# EAGLE design cpx-synth2-B (EAGLE 8.6.3)
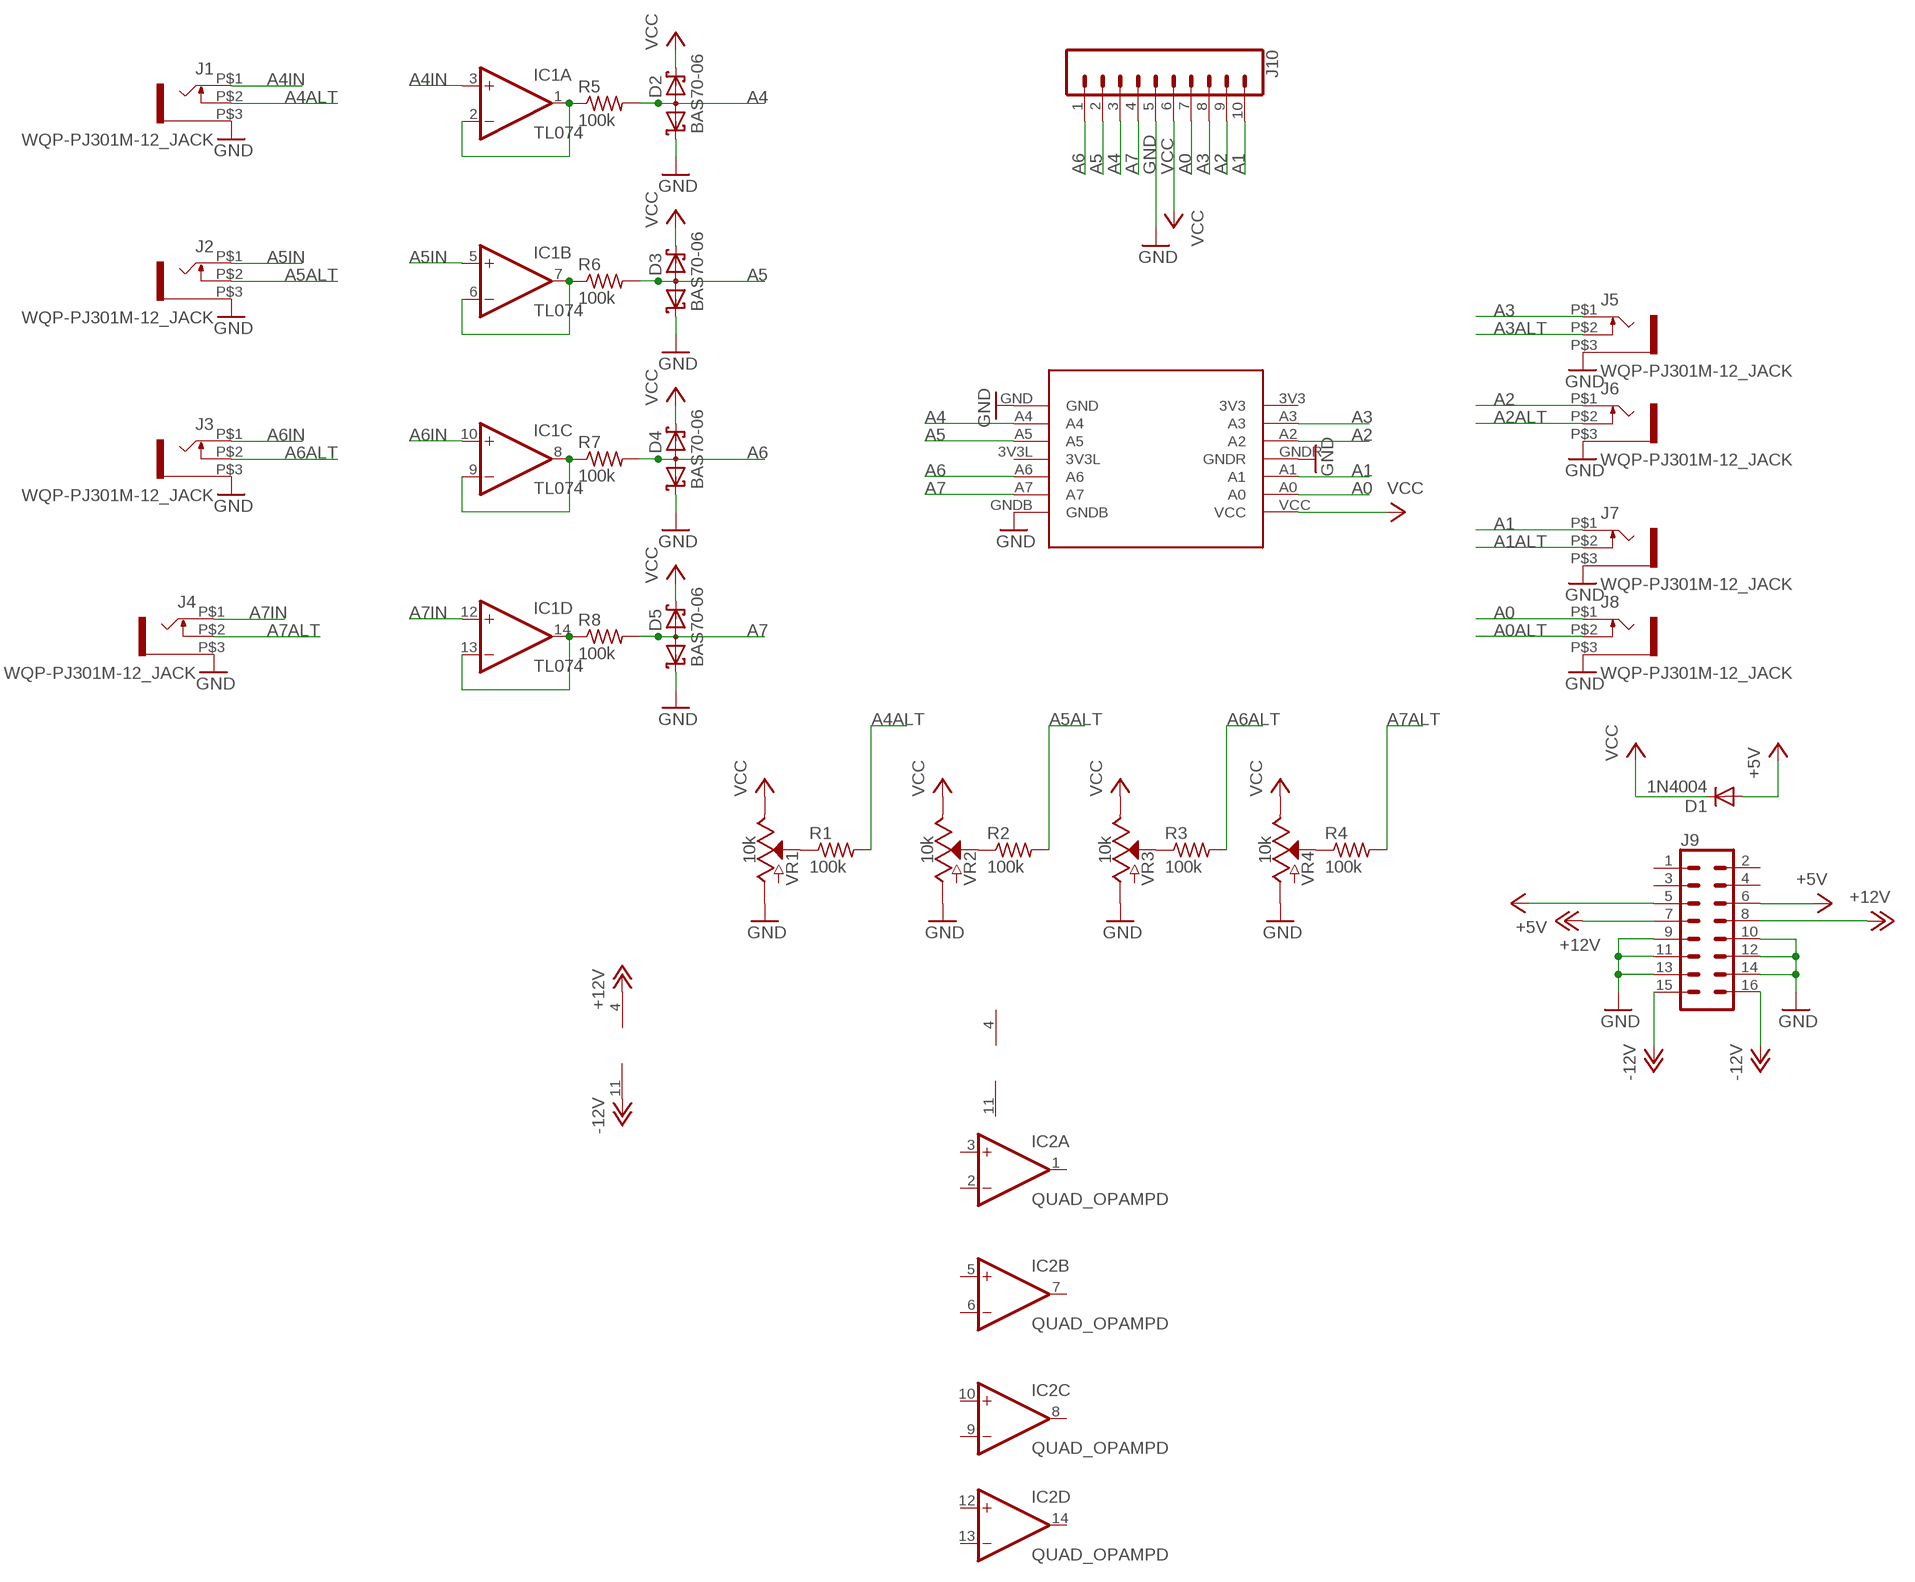
[diagram p0: schematic, sheet 1]

## Parts
D1  1N4004  [DO41-10]
D2  BAS70-06  [SOT23]
D3  BAS70-06  [SOT23]
D4  BAS70-06  [SOT23]
D5  BAS70-06  [SOT23]
IC1  TL074  QUAD_OPAMPD  [SO14]
IC2  QUAD_OPAMPD  [SO14]
J1  WQP-PJ301M-12_JACK  [WQP-PJ301M-12_JACK]
J2  WQP-PJ301M-12_JACK  [WQP-PJ301M-12_JACK]
J3  WQP-PJ301M-12_JACK  [WQP-PJ301M-12_JACK]
J4  WQP-PJ301M-12_JACK  [WQP-PJ301M-12_JACK]
J5  WQP-PJ301M-12_JACK  [WQP-PJ301M-12_JACK]
J6  WQP-PJ301M-12_JACK  [WQP-PJ301M-12_JACK]
J7  WQP-PJ301M-12_JACK  [WQP-PJ301M-12_JACK]
J8  WQP-PJ301M-12_JACK  [WQP-PJ301M-12_JACK]
J9  CONN_08X2  [2X8]
J10  CONN_10"  [1X10]
R1  100k  R-US_R0603  [R0603]
R2  100k  R-US_R0603  [R0603]
R3  100k  R-US_R0603  [R0603]
R4  100k  R-US_R0603  [R0603]
R5  100k  R-US_R0603  [R0603]
R6  100k  R-US_R0603  [R0603]
R7  100k  R-US_R0603  [R0603]
R8  100k  R-US_R0603  [R0603]
U1  CIRCUITPLAYGROUNDEXPRESS  [CIRCUITPLAYGROUNDEXPRESS]
VR1  10k  POTENTIOMETER-PTH-9MM-1/20W-20%-KIT  [POT-PTH-ALPS-KIT]
VR2  10k  POTENTIOMETER-PTH-9MM-1/20W-20%-KIT  [POT-PTH-ALPS-KIT]
VR3  10k  POTENTIOMETER-PTH-9MM-1/20W-20%-KIT  [POT-PTH-ALPS-KIT]
VR4  10k  POTENTIOMETER-PTH-9MM-1/20W-20%-KIT  [POT-PTH-ALPS-KIT]

## Nets
+5V: D1.A J9.5 J9.6
+12V: IC1.4(P:V+) J9.7 J9.8
-12V: IC1.11(P:V-) J9.15 J9.16
A0: J8.P$1 J10.7 U1.A0
A0ALT: J8.P$2
A1: J7.P$1 J10.10 U1.A1
A1ALT: J7.P$2
A2: J6.P$1 J10.9 U1.A2
A2ALT: J6.P$2
A3: J5.P$1 J10.8 U1.A3
A3ALT: J5.P$2
A4: D2.3(AA) J10.3 R5.2 U1.A4
A4ALT: J1.P$2 R1.2
A4IN: IC1.3(A:+IN) J1.P$1
A5: D3.3(AA) J10.2 R6.2 U1.A5
A5ALT: J2.P$2 R2.2
A5IN: IC1.5(B:+IN) J2.P$1
A6: D4.3(AA) J10.1 R7.2 U1.A6
A6ALT: J3.P$2 R3.2
A6IN: IC1.10(C:+IN) J3.P$1
A7: D5.3(AA) J10.4 R8.2 U1.A7
A7ALT: J4.P$2 R4.2
A7IN: IC1.12(D:+IN) J4.P$1
GND: D2.1(K1) D3.1(K1) D4.1(K1) D5.1(K1) J1.P$3 J2.P$3 J3.P$3 J4.P$3 J5.P$3 J6.P$3 J7.P$3 J8.P$3 J9.9 J9.10 J9.11 J9.12 J9.13 J9.14 J10.5 U1.GND U1.GNDB U1.GNDR VR1.P$3(A) VR2.P$3(A) VR3.P$3(A) VR4.P$3(A)
N$1: R1.1 VR1.P$2(S)
N$2: R2.1 VR2.P$2(S)
N$3: R3.1 VR3.P$2(S)
N$4: R4.1 VR4.P$2(S)
N$5: IC1.6(B:-IN) IC1.7(B:OUT) R6.1
N$6: IC1.8(C:OUT) IC1.9(C:-IN) R7.1
N$7: IC1.1(A:OUT) IC1.2(A:-IN) R5.1
N$10: IC1.13(D:-IN) IC1.14(D:OUT) R8.1
VCC: D1.C D2.2(K2) D3.2(K2) D4.2(K2) D5.2(K2) J10.6 U1.VCC VR1.P$1(E) VR2.P$1(E) VR3.P$1(E) VR4.P$1(E)
Unconnected: IC2.1(A:OUT) IC2.2(A:-IN) IC2.3(A:+IN) IC2.5(B:+IN) IC2.6(B:-IN) IC2.7(B:OUT) IC2.8(C:OUT) IC2.9(C:-IN) IC2.10(C:+IN) IC2.12(D:+IN) IC2.13(D:-IN) IC2.14(D:OUT) J9.1 J9.2 J9.3 J9.4 U1.3V3 U1.3V3L

## Power pins joined to a net without a drawn wire
V+: IC2.4(P:V+)
V-: IC2.11(P:V-)

## Library data of the parts
D1 = adafruit:1N4004: DIODE General purpose 1N400x type rectifier (With bigger pads) http://www.ladyada.net/library/pcb/eaglelibrary.html
D2-D5 = diode:BAS70-06: Silicon Schottky Diodes General-purpose diode for high-speed switching
IC1 IC2 = adafruit:QUAD_OPAMP: OP AMP Standard quad package
J1-J8 = thonkiconn:WQP-PJ301M-12_JACK
J9 = SparkFun-Connectors:CONN_08X2: Multi connection point. Often used as Generic Header-pin footprint for 0.1 inch spaced/style header connections You can populate with any combo of single row headers, but if you'd like an exact match, check this: Header - 2x8 (Male, 0.1") <https://www.sparkfun.com/products/13156> (PRT-13156) On any of the 0.1 inch spaced packages, you can populate with these: Break Away Headers - Straight <https://www.sparkfun.com/products/116> (PRT-00116) Break Away Male Headers - Right Angle <https://www.sparkfun.com/products/553> (PRT-00553) Female Headers <https://www.sparkfun.com/products/115> (PRT-00115) Break Away Headers - Machine Pin <https://www.sparkfun.com/products/117> (PRT-00117) Break Away Female Headers - Swiss Machine Pin <https://www.sparkfun.com/products/743> (PRT-00743)
J10 = SparkFun-Connectors:CONN_10: Multi connection point. Often used as Generic Header-pin footprint for 0.1 inch spaced/style header connections On any of the 0.1 inch spaced packages, you can populate with these: Break Away Headers - Straight <https://www.sparkfun.com/products/116> (PRT-00116) Break Away Male Headers - Right Angle <https://www.sparkfun.com/products/553> (PRT-00553) Female Headers <https://www.sparkfun.com/products/115> (PRT-00115) Break Away Headers - Machine Pin <https://www.sparkfun.com/products/117> (PRT-00117) Break Away Female Headers - Swiss Machine Pin <https://www.sparkfun.com/products/743> (PRT-00743) Arduino Stackable Header - 10 Pin <https://www.sparkfun.com/products/11376> (PRT-11376) For SCREWTERMINALS and SPRING TERMINALS visit here: Screw Terimnals on SparkFun.com <https://www.sparkfun.com/search/results?term=Screw+Terminals> (5mm/3.5mm/2.54mm spacing) This device is also useful as a general connection point to wire up your design to another part of your project. Our various solder wires solder well into these plated through hole pads. Hook-Up Wire - Assortment (Stranded, 22 AWG) <https://www.sparkfun.com/products/11375> (PRT-11375) Hook-Up Wire - Assortment (Solid Core, 22 AWG) <https://www.sparkfun.com/products/11367> (PRT-11367) View the entire wire category on our website here <https://www.sparkfun.com/categories/141> Special notes: Molex polarized connector foot print use with SKU : PRT-08231 with associated crimp pins and housings. 1MM SMD Version SKU: PRT-10208 NOTES ON THE VARIANTS LOCK and LOCK_LONGPADS... This footprint was designed to help hold the alignment of a through-hole component (i.e. 6-pin header) while soldering it into place. You may notice that each hole has been shifted either up or down by 0.005 of an inch from it's more standard position (which is a perfectly straight line). This slight alteration caused the pins (the squares in the middle) to touch the edges of the holes. Because they are alternating, it causes a "brace" to hold the component in place. 0.005 has proven to be the perfect amount of "off-center" position when using our standard breakaway headers. Although looks a little odd when you look at the bare footprint, once you have a header in there, the alteration is very hard to notice. Also,if you push a header all the way into place, it is covered up entirely on the bottom side.; PROD_ID: CONN-11563
R1-R8 = adafruit:R-US_: RESISTOR, American symbol
U1 = todstuff:CIRCUITPLAYGROUNDEXPRESS
VR1-VR4 = SparkFun-Resistors:POTENTIOMETER: Potentiometer (Pot) Three-terminal potentiometers, with an adjustable wiper and two adjustable resistors. A pot can be used to create a configurable voltage divider, or as a variable resistor. Variants ALPS_POT and ALPS_POT_KIT - PTH, breadboard compatible, 9mm square pots Rotary Potentiometer - Linear (10k ohm) <https://www.sparkfun.com/products/9288> (COM-09288) The KIT variant exposes copper on only one side of the PTH pad, so the part can only be assembled on one side of the PCB. Useful for beginner soldering kits.; PROD_ID: RES-09177; SF_SKU: COM-09288

## Board
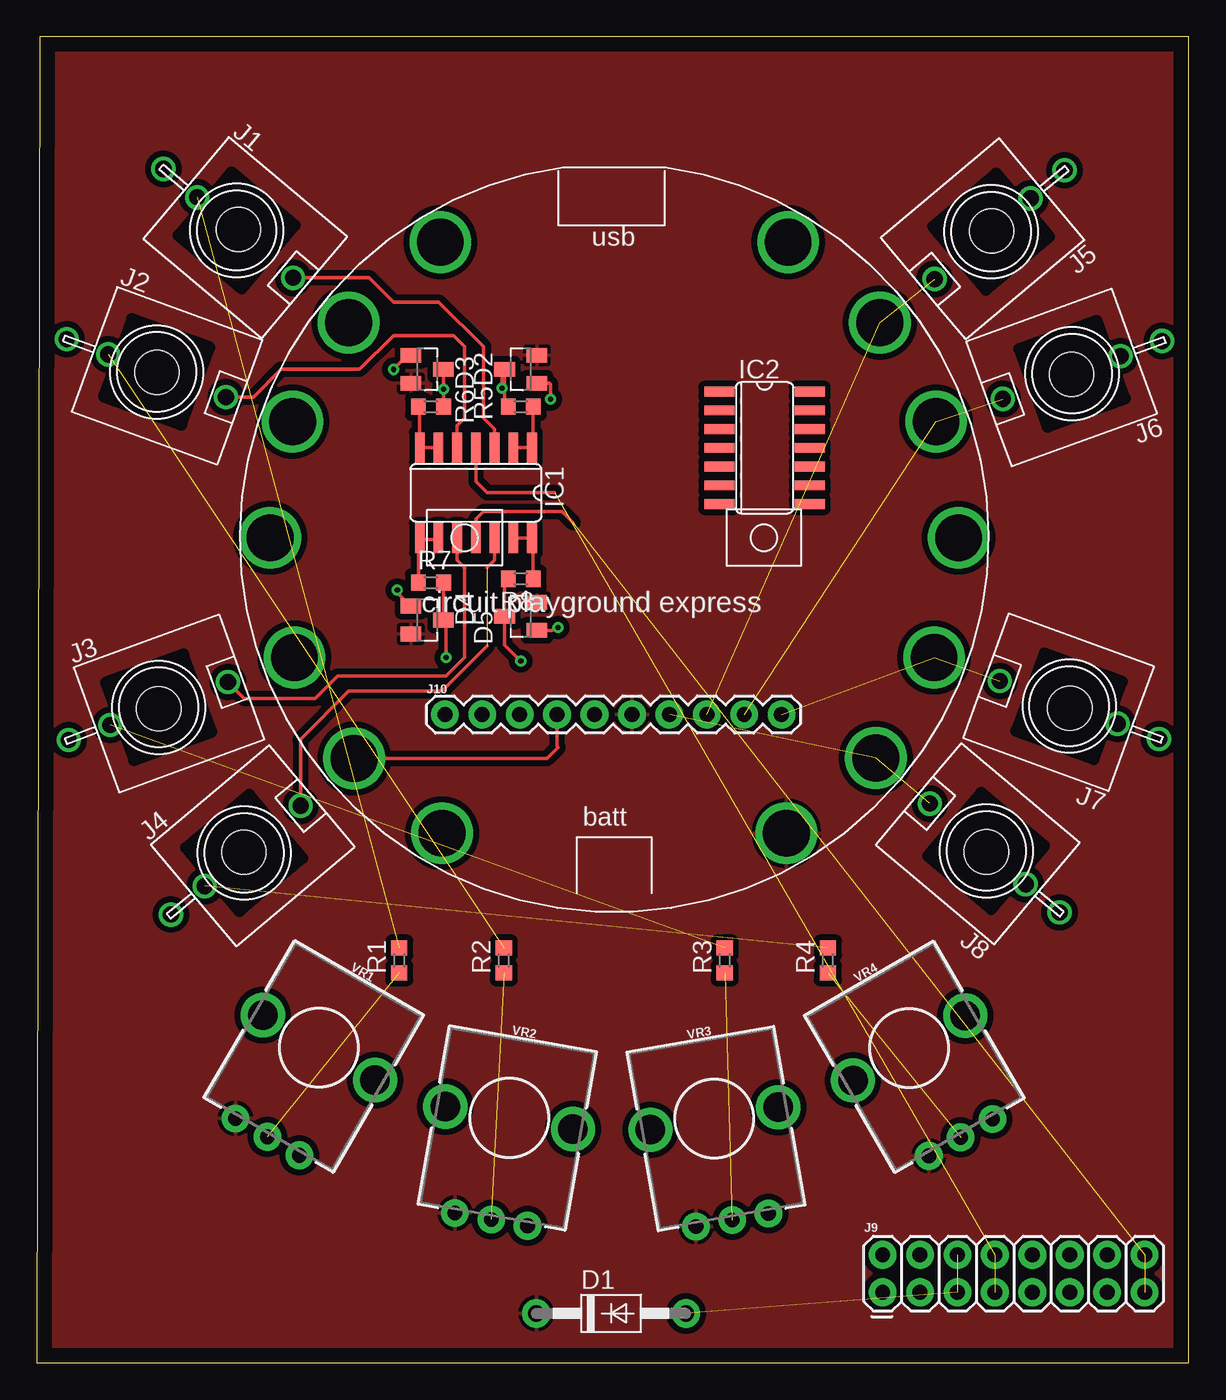
[diagram p1: board, top side]
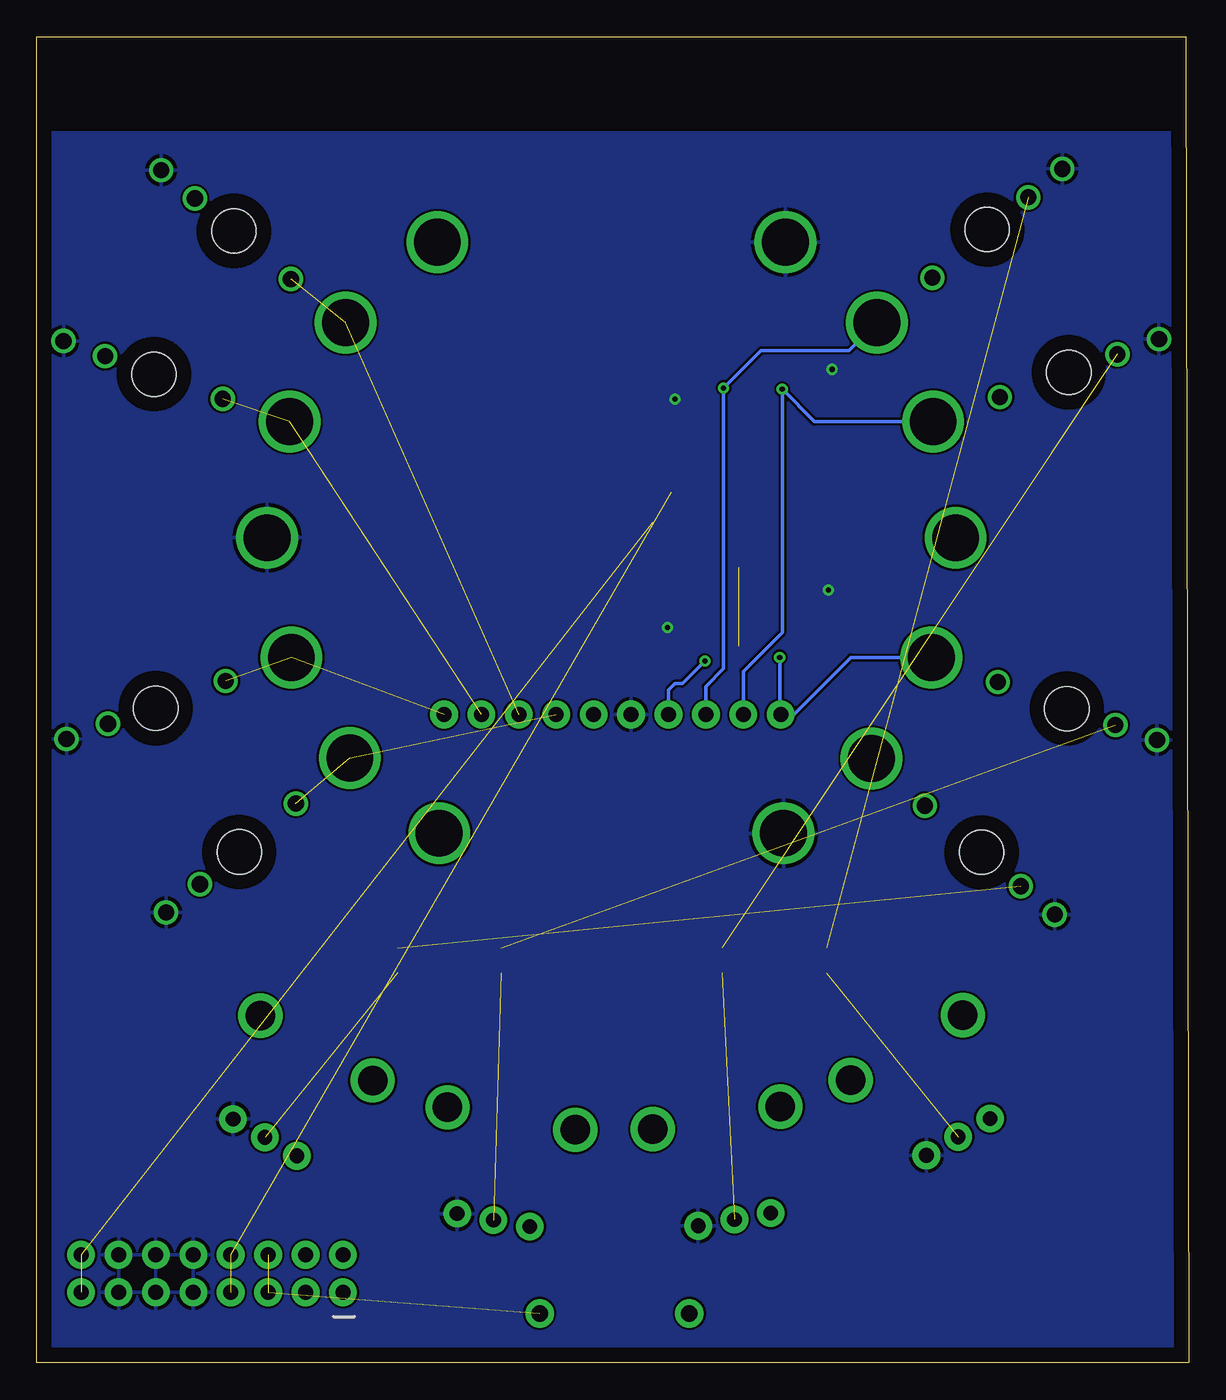
[diagram p2: board, bottom side, seen from below]

Size 78.2 x 90 mm. Coordinates in mm from the lower left corner, seen from the top.
Outline: 0,0 78.2,0 78.2,90 0.2,90 0,0
Copper layers (1*16): Top 0.035mm / dielectric 1.5mm / Bottom 0.035mm
Design rules "default": minimum track width 6mil, minimum drill 0.35mm, track to track 6mil, track to pad 6mil, pad to pad 6mil, via to via 6mil, smd to smd 6mil, copper to edge 40mil, drill to drill 6mil, minimum pad ring 10mil, minimum via ring 8mil, stop-mask expansion 4mil, vias tented up to drill 0mil, thermal gap 10mil
Holes 3 mm at 13.68,76.92 8.15,67.22 8.27,44.4 14.06,34.64 64.46,34.66 70.13,44.42 70.25,67.09 64.82,76.82

### Footprints (pad centres in the part's own frame; a part is rotated, then mirrored left to right if it is on the bottom)
DO41-10 = drill 1.118 pad 1.93: A 5.08,0; C -5.08,0
SOT23 = smd 1 x 1.4: 1 -0.95,-1.1; 2 0.95,-1.1; 3 0,1.1
SO14 = smd 0.66 x 2.032: 1 -3.81,-3.073; 2 -2.54,-3.073; 3 -1.27,-3.073; 4 0,-3.073; 5 1.27,-3.073; 6 2.54,-3.073; 7 3.81,-3.073; 8 3.81,3.073; 9 2.54,3.073; 10 1.27,3.073; 11 0,3.073; 12 -1.27,3.073; 13 -2.54,3.073; 14 -3.81,3.073
WQP-PJ301M-12_JACK = drill 1.1: P$1 0,5; P$2 0,-3.5; P$3 0,-6.5
2X8 = drill 1.016 pad 1.88: 1 0,0; 2 0,2.54; 3 2.54,0; 4 2.54,2.54; 5 5.08,0; 6 5.08,2.54; 7 7.62,0; 8 7.62,2.54; 9 10.16,0; 10 10.16,2.54; 11 12.7,0; 12 12.7,2.54; 13 15.24,0; 14 15.24,2.54; 15 17.78,0; 16 17.78,2.54
1X10 = drill 1.016 pad 1.88: 1 0,0; 2 2.54,0; 3 5.08,0; 4 7.62,0; 5 10.16,0; 6 12.7,0; 7 15.24,0; 8 17.78,0; 9 20.32,0; 10 22.86,0
R0603 = smd 1 x 1.1: 1 -0.85,0; 2 0.85,0
CIRCUITPLAYGROUNDEXPRESS = drill 3.175: 3V3 11.811,20.066; 3V3L -23.368,0; A0 17.755,-14.961; A1 21.717,-8.128; A2 21.844,7.874; A3 18.034,14.605; A4 -18.034,14.605; A5 -21.844,7.874; A6 -21.717,-8.128; A7 -17.653,-14.986; GND -11.811,20.066; GNDB -11.684,-20.066; GNDR 23.368,0; VCC 11.684,-20.066
POT-PTH-ALPS-KIT = drill 1 pad 1.88: P$1 7,-2.5; P$2 7,0; P$3 7,2.5 | drill 2: P$4 0,-4.4; P$5 0,4.4

### Placement (x,y rotation side)
D1  38.99,3.35 0 top
D2  32.85,67.43 90 top
D3  26.5,67.43 270 top
D4  26.5,50.41 270 top
D5  32.85,50.67 90 top
IC1  29.8,59.05 180 top
IC2  49.4,62.1 270 top
J1  13.57,76.86 230 top
J2  8.13,67.25 250 top
J3  8.27,44.49 290 top
J4  14.08,34.6 310 top
J5  64.78,76.77 130 top
J6  70.28,67.13 110 top
J7  70.08,44.56 70 top
J8  64.45,34.74 50 top
J9  57.42,4.78 0 top
J10  27.7,44 0 top
R1  24.6,27.3 90 top
R2  31.7,27.3 90 top
R3  46.7,27.3 90 top
R4  53.7,27.3 90 top
R5  32.85,64.89 180 top
R6  26.75,64.89 0 top
R7  26.75,52.95 0 top
R8  32.85,53.21 180 top
U1  39.2,56 0 top
VR1  19.15,21.39 240 top
VR2  32.06,16.62 260 top
VR3  45.99,16.57 280 top
VR4  59.21,21.35 300 top

### Tracks (layer width: path | path; a pad name or v marks a point on that pad's centre or on a via)
+5V  (2 unrouted)
+12V  (2 unrouted)
  Top 0.254: IC1.4 29.8,59.81 30.56,59.05 35.14,59.05
-12V  (2 unrouted)
  Top 0.254: IC1.11 29.8,57.27 30.31,57.78 35.64,57.78 36.41,57.02
A0  (2 unrouted)
A1  (2 unrouted)
A2  (2 unrouted)
A3  (2 unrouted)
A4  (via drill 0.35)
  Top 0.254: R5.2 31.75,65.39 D2.3 31.58,67.6 v31.58,66.16
  Bottom 0.254: J10.3 32.78,45.91 31.58,47.11 v31.58,66.16 29.04,68.7 23.07,68.7 U1.A4
A4ALT  (1 unrouted)
A4IN
  Top 0.254: IC1.3 31.07,63.37 30.31,64.13 30.31,68.95 27.26,72 24.21,72 22.57,73.64 J1.P$1
A5  (via drill 0.35)
  Top 0.254: R6.2 D3.3 v27.6,66.08
  Bottom 0.254: J10.2 30.24,46.93 27.6,49.57 v27.6,66.08 25.4,63.87 U1.A5
A5ALT  (1 unrouted)
A5IN
  Top 0.254: J2.P$1 14.71,65.54 16.59,67.43 21.93,67.43 24.21,69.72 28.28,69.72 29.04,68.95 29.04,64.13 28.53,63.62 IC1.5
A6  (via drill 0.35)
  Top 0.254: R7.2 D4.3 27.77,50.24 v27.77,47.87 | 27.6,44.1 J10.1
  Bottom 0.254: U1.A6 22.94,47.87 26.82,44 J10.1 27.77,44.07 v27.77,47.87
A6ALT  (1 unrouted)
A6IN
  Top 0.254: IC1.10 28.53,54.48 29.04,53.97 29.04,47.87 27.77,46.6 20.4,46.6 18.88,45.08 14.09,45.08 J3.P$1
A7  (via drill 0.35)
  Top 0.254: R8.2 31.75,52.96 D5.3 31.75,48.72 v32.85,47.62 | U1.A7 34.63,41.01 35.39,41.78 35.32,41.85 J10.4
  Bottom 0.254: v32.85,47.62 34.37,46.09 34.88,46.09 35.32,45.66 J10.4
A7ALT  (1 unrouted)
A7IN  (1 unrouted)
  Top 0.254: IC1.12 31.07,54.48 30.56,53.97 | 30.56,48.63 27.52,45.59 21.17,45.59 17.86,42.28 17.91,42.24 J4.P$1
GND  (via drill 0.35)
  Top 0.254: D2.1 34.82,66.48 34.88,66.41 v34.88,65.4 | D5.1 34.95,49.72 v35.39,49.9 | D4.1 24.47,52.29 v24.47,52.44 | D3.1 25.16,68.38 v24.21,67.43
  pour Bottom: -1.8,83.5 80.2,83.5 80.2,-1.3 -1.8,-1.3
N$1  (1 unrouted)
N$2  (1 unrouted)
N$3  (1 unrouted)
N$4  (1 unrouted)
N$5
  Top 0.254: IC1.6 IC1.7 25.99,64.8 R6.1
N$6
  Top 0.254: IC1.8 25.9,55.89 | 25.9,55.89 R7.1 | IC1.9 27.17,55.89 25.9,55.89
N$7
  Top 0.254: IC1.2 IC1.1 33.7,62.21 R5.1
N$10
  Top 0.254: IC1.13 IC1.14 33.7,55.89 R8.1
VCC
  pour Top (isolate 0.406): 0.2,102 arc63 78.26,100.36 78.76,-2.06 -0.76,-0.56